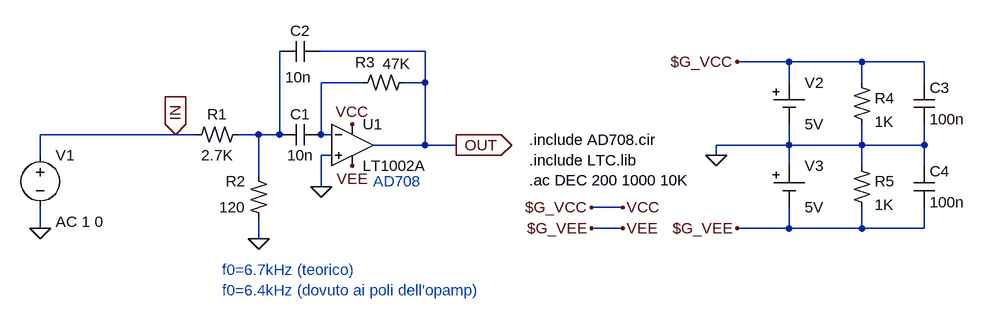
[diagram p0: schematic Boltz-2-bandpass.asc]
Boltz-2-bandpass.asc, the LTspice schematic file:
Version 4
SHEET 1 1124 680
WIRE 288 144 128 144
WIRE 800 160 768 160
WIRE 848 160 800 160
WIRE 960 160 848 160
WIRE 1056 160 960 160
WIRE 192 192 128 192
WIRE 288 192 288 144
WIRE 288 192 256 192
WIRE 848 192 848 160
WIRE 960 192 960 160
WIRE 1056 192 1056 160
WIRE -96 272 -304 272
WIRE -64 272 -96 272
WIRE 32 272 0 272
WIRE 64 272 64 144
WIRE 64 272 32 272
WIRE 128 272 128 192
WIRE 144 272 128 272
WIRE 288 288 288 192
WIRE 288 288 208 288
WIRE 336 288 288 288
WIRE 848 288 848 256
WIRE 848 288 736 288
WIRE 960 288 960 256
WIRE 960 288 848 288
WIRE 1056 288 1056 256
WIRE 1056 288 960 288
WIRE -304 304 -304 272
WIRE 144 304 128 304
WIRE 736 304 736 288
WIRE 848 320 848 288
WIRE 960 320 960 288
WIRE 1056 320 1056 288
WIRE 32 336 32 272
WIRE 128 352 128 304
WIRE 560 384 544 384
WIRE 592 384 560 384
WIRE -304 416 -304 384
WIRE 592 416 544 416
WIRE 848 416 848 384
WIRE 848 416 768 416
WIRE 960 416 960 384
WIRE 960 416 848 416
WIRE 1056 416 1056 384
WIRE 1056 416 960 416
WIRE 32 432 32 400
FLAG 176 256 VCC
FLAG 592 384 VCC
FLAG 176 320 VEE
FLAG 592 416 VEE
FLAG -96 272 IN
IOPIN -96 272 In
FLAG 32 432 0
FLAG 128 352 0
FLAG 544 384 $G_VCC
FLAG 544 416 $G_VEE
FLAG 336 288 OUT
IOPIN 336 288 Out
FLAG -304 416 0
FLAG 736 304 0
FLAG 768 416 $G_VEE
FLAG 768 160 $G_VCC
DATAFLAG 560 384 "$"
DATAFLAG 800 160 "$"
SYMBOL res2 0 256 R90
WINDOW 0 0 32 VBottom 2
WINDOW 3 32 32 VTop 2
SYMATTR InstName R1
SYMATTR Value 2.7K
SYMBOL res2 48 400 R180
WINDOW 0 36 56 Left 2
WINDOW 3 36 16 Left 2
SYMATTR InstName R2
SYMATTR Value 120
SYMBOL res2 192 208 R270
WINDOW 0 32 4 VTop 2
WINDOW 3 61 52 VBottom 2
SYMATTR InstName R3
SYMATTR Value 47K
SYMBOL cap 128 256 R90
WINDOW 0 0 32 VBottom 2
WINDOW 3 32 32 VTop 2
SYMATTR InstName C1
SYMATTR Value 10n
SYMBOL cap 128 128 R90
WINDOW 0 0 32 VBottom 2
WINDOW 3 40 35 VTop 2
SYMATTR InstName C2
SYMATTR Value 10n
SYMBOL voltage -304 288 R0
WINDOW 3 24 96 Invisible 2
WINDOW 123 24 118 Left 2
SYMATTR Value SINE(0 1 1)
SYMATTR Value2 AC 1 0
SYMATTR InstName V1
SYMBOL Misc/cell 848 192 R0
SYMATTR InstName V2
SYMATTR Value 5V
SYMBOL Misc/cell 848 320 R0
SYMATTR InstName V3
SYMATTR Value 5V
SYMBOL res2 944 192 R0
SYMATTR InstName R4
SYMATTR Value 1K
SYMBOL res2 944 320 R0
SYMATTR InstName R5
SYMATTR Value 1K
SYMBOL cap 1040 192 R0
SYMATTR InstName C3
SYMATTR Value 100n
SYMBOL cap 1040 320 R0
SYMATTR InstName C4
SYMATTR Value 100n
SYMBOL Opamps/LT1002A 176 224 R0
SYMATTR InstName U1
TEXT -24 480 Left 2 ;f0=6.7kHz (teorico)\nf0=6.4kHz (dovuto ai poli dell'opamp)
TEXT 448 280 Left 2 !.include AD708.cir\n.include LTC.lib\n.ac DEC 200 1000 10K
TEXT 208 344 Left 2 ;AD708

The netlist it stands for:
* Boltz-2-bandpass.asc
R1 N002 IN 2.7K
R2 0 N002 120
R3 N001 OUT 47K
C1 N001 N002 10n
C2 OUT N002 10n
V1 IN 0 SINE(0 1 1) AC 1 0
V2 $G_VCC 0 5V
V3 0 $G_VEE 5V
R4 $G_VCC 0 1K
R5 0 $G_VEE 1K
C3 $G_VCC 0 100n
C4 0 $G_VEE 100n
XU1 0 N001 $G_VCC $G_VEE OUT LT1002A  ; pins In+ In- V+ V- OUT
* f0=6.7kHz (teorico)
* f0=6.4kHz (dovuto ai poli dell'opamp)
.include AD708.cir
.include LTC.lib
.ac DEC 200 1000 10K
* AD708
.backanno
.end